# Altium project Smart-Telecontrol.PrjPcb
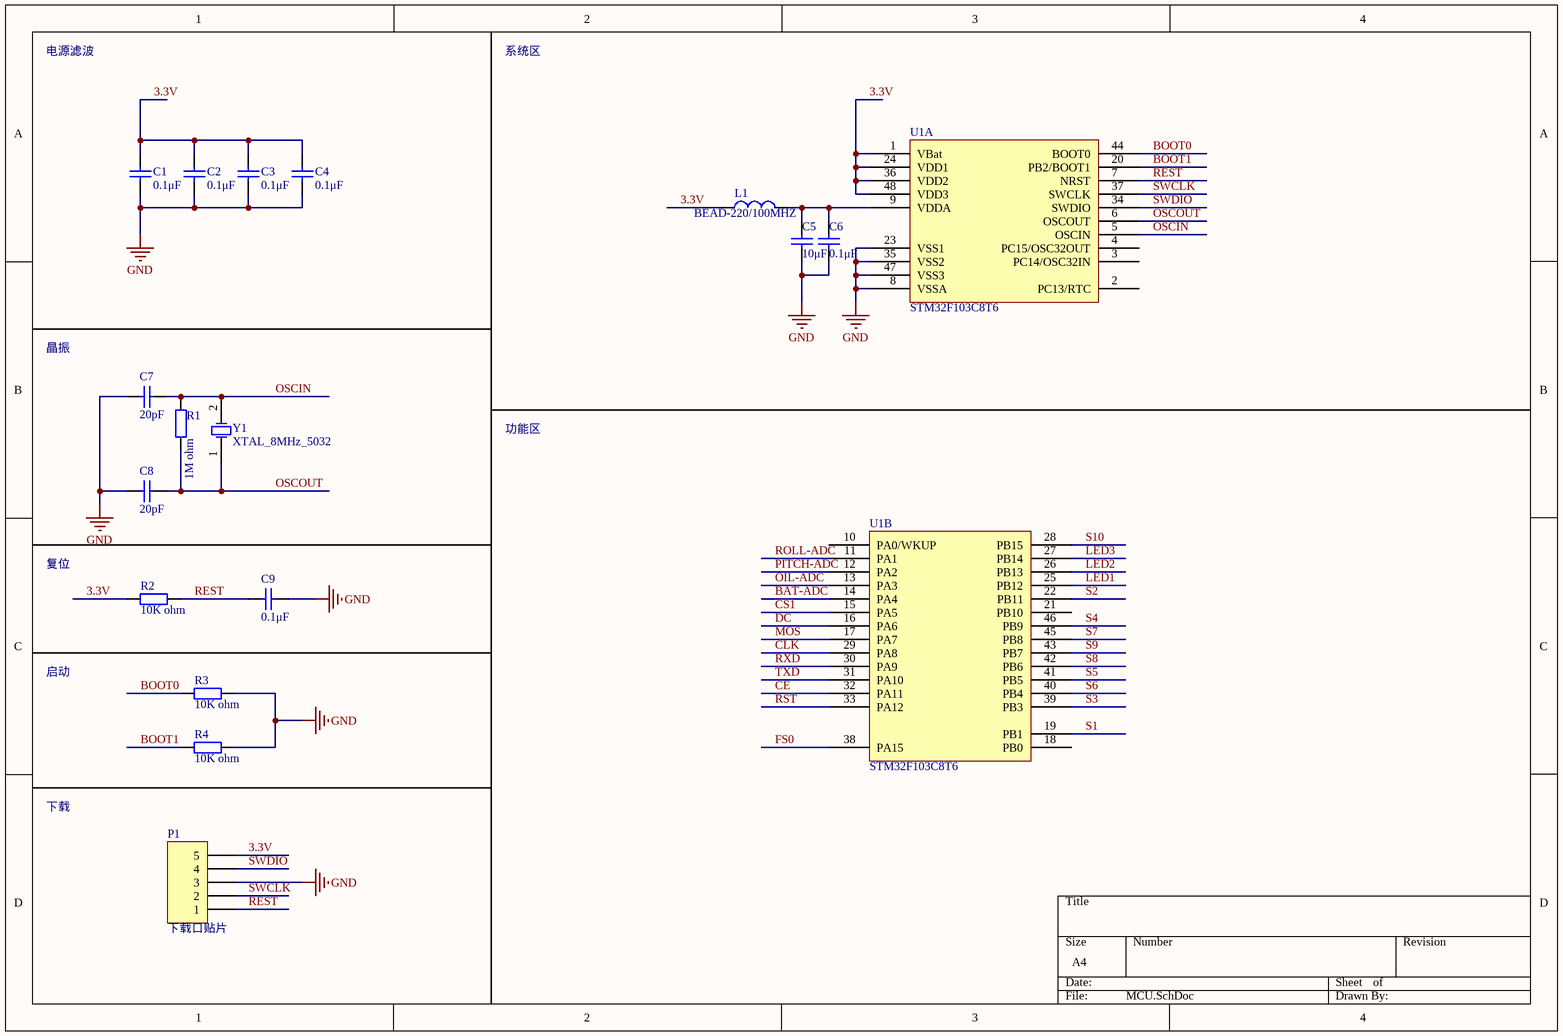
[diagram p0: MCU.SchDoc]
2 sheets, 92 parts. Net scope: global (net labels, ports and power ports of the same name join across sheets).
Board file: Smart-Telecontrol.PcbDoc
Sheets:
  MCU.SchDoc
  Module.SchDoc

## Sheet MCU.SchDoc
size A4

### Parts
C1  0.1μF  [0603C]
C2  0.1μF  [0603C]
C3  0.1μF  [0603C]
C4  0.1μF  [0603C]
C5  10μF  [0603C]
C6  0.1μF  [0603C]
C7  20pF  [0603C]
C8  20pF  [0603C]
C9  0.1μF  [0603C]
L1  BEAD-220/100MHZ  [0603R]
P1  下载口贴片  [HDR1X5 - danceng]
R1  1M ohm  [0603R]
R2  10K ohm  [0603R]
R3  10K ohm  [0603R]
R4  10K ohm  [0603R]
U1  STM32F103C8T6  [LQFP48]  (parts A,B of 2)
Y1  XTAL_8MHz_5032  [5032]

### Nets
GND: C1.1 C2.1 C3.1 C4.1 C5.1 C6.1 C7.2 C8.2 C9.1 P1.3 R3.2 R4.2 U1.8(VSSA) U1.23(VSS1) U1.35(VSS2) U1.47(VSS3)
3.3V: C1.2 C2.2 C3.2 C4.2 L1.1 P1.5 R2.1 U1.1(VBat) U1.24(VDD1) U1.36(VDD2) U1.48(VDD3)
BAT-ADC: U1.14(PA4)
BOOT0: R3.1 U1.44(BOOT0)
BOOT1: R4.1 U1.20(PB2/BOOT1)
CE: U1.32(PA11)
CLK: U1.29(PA8)
CS1: U1.15(PA5)
DC: U1.16(PA6)
FS0: U1.38(PA15)
LED1: U1.25(PB12)
LED2: U1.26(PB13)
LED3: U1.27(PB14)
MOS: U1.17(PA7)
OIL-ADC: U1.13(PA3)
OSCIN: C7.1 R1.2 U1.5(OSCIN) Y1.2(OSC2)
OSCOUT: C8.1 R1.1 U1.6(OSCOUT) Y1.1(OSC1)
PITCH-ADC: U1.12(PA2)
REST: C9.2 P1.1 R2.2 U1.7(NRST)
ROLL-ADC: U1.11(PA1)
RST: U1.33(PA12)
RXD: U1.30(PA9)
S1: U1.19(PB1)
S2: U1.22(PB11)
S3: U1.39(PB3)
S4: U1.46(PB9)
S5: U1.41(PB5)
S6: U1.40(PB4)
S7: U1.45(PB8)
S8: U1.42(PB6)
S9: U1.43(PB7)
S10: U1.28(PB15)
SWCLK: P1.2 U1.37(SWCLK)
SWDIO: P1.4 U1.34(SWDIO)
TXD: U1.31(PA10)
NetC5_2: C5.2 C6.2 L1.2 U1.9(VDDA)

Not connected (* = marked no-connect by the designer): U1 2(PC13/RTC) 3(PC14/OSC32IN) 4(PC15/OSC32OUT) 10(PA0/WKUP) 18(PB0) 21(PB10)

### Notes on the sheet
- 电源滤波
- 系统区
- 晶振
- 功能区
- 复位
- 启动
- 下载

### Library data of the parts
C1-C4 C6 C9 = Cap_0.1μF_50V_0603: 0.1μF_50V,X7R,±5%; 物料名称: 贴片陶瓷电容; 制造商: muRata; 物料编码: TCC0087; 物料型号: GRM188R71H104JA93D; 单位: PCS; 物料规格: 0.1μF_50V,X7R,±5%
C5 = Cap_10μF_35V_0603: 10μF_35V,X5R,20%; 物料规格: 10μF_35V,20%; 物料名称: 贴片陶瓷电容; 制造商: muRata; 物料编码: TCC0071; 物料型号: GRM188R6YA106MA73D; 单位: PCS
C7 C8 = Cap_20pF_50V_0603: 20pF_50V,CH,±5%; 物料名称: 贴片陶瓷电容; 制造商: muRata; 物料编码: TCC0036; 物料型号: GRM1882C1H200JA01D; 单位: PCS; 物料规格: 20pF_50V,CH,±5%
L1 = BEAD-220/100MHZ_0603: 物料名称: 磁珠; 制造商: TDK; 物料编码: TCZ0006; 物料型号: MMZ1608B221CTAH0; 单位: PCS; 物料规格: BEAD-220/100MHZ
P1 = DAP下载口贴片: 制造商: NA; 单位: PCS; 物料规格: DAP下载口贴片; 物料名称: DAP下载口贴片; 物料编码: NA; 物料型号: DAP下载口贴片
R1 = Res_1M ohm_0603: 1M ohm,1%; 物料名称: 贴片电阻; 制造商: YAGEO; 物料编码: TRS0067; 物料型号: RC0603FR-071ML; 单位: PCS; 物料规格: 1M ohm,1%
R2-R4 = Res_10K ohm_0603: 10K ohm,1%; 物料名称: 贴片电阻; 制造商: YAGEO; 物料编码: TRS0020; 物料型号: RC0603FR-0710KL; 单位: PCS; 物料规格: 10K ohm,1%
U1 = STM32F103C8T6: 物料名称: 单片机; 制造商: ST; 物料编码: TIC0036; 单位: PCS; 物料规格: STM32F103C8T6; 物料型号: STM32F103C8T6
Y1 = XTAL_8MHz_5032: XTAL_8MHz; 物料规格: 8MHz; 物料名称: 晶振; 制造商: TAITIEN; 物料编码: NA; 物料型号: XIHCCCNANF-8.000; 单位: PCS

## Sheet Module.SchDoc
size A3
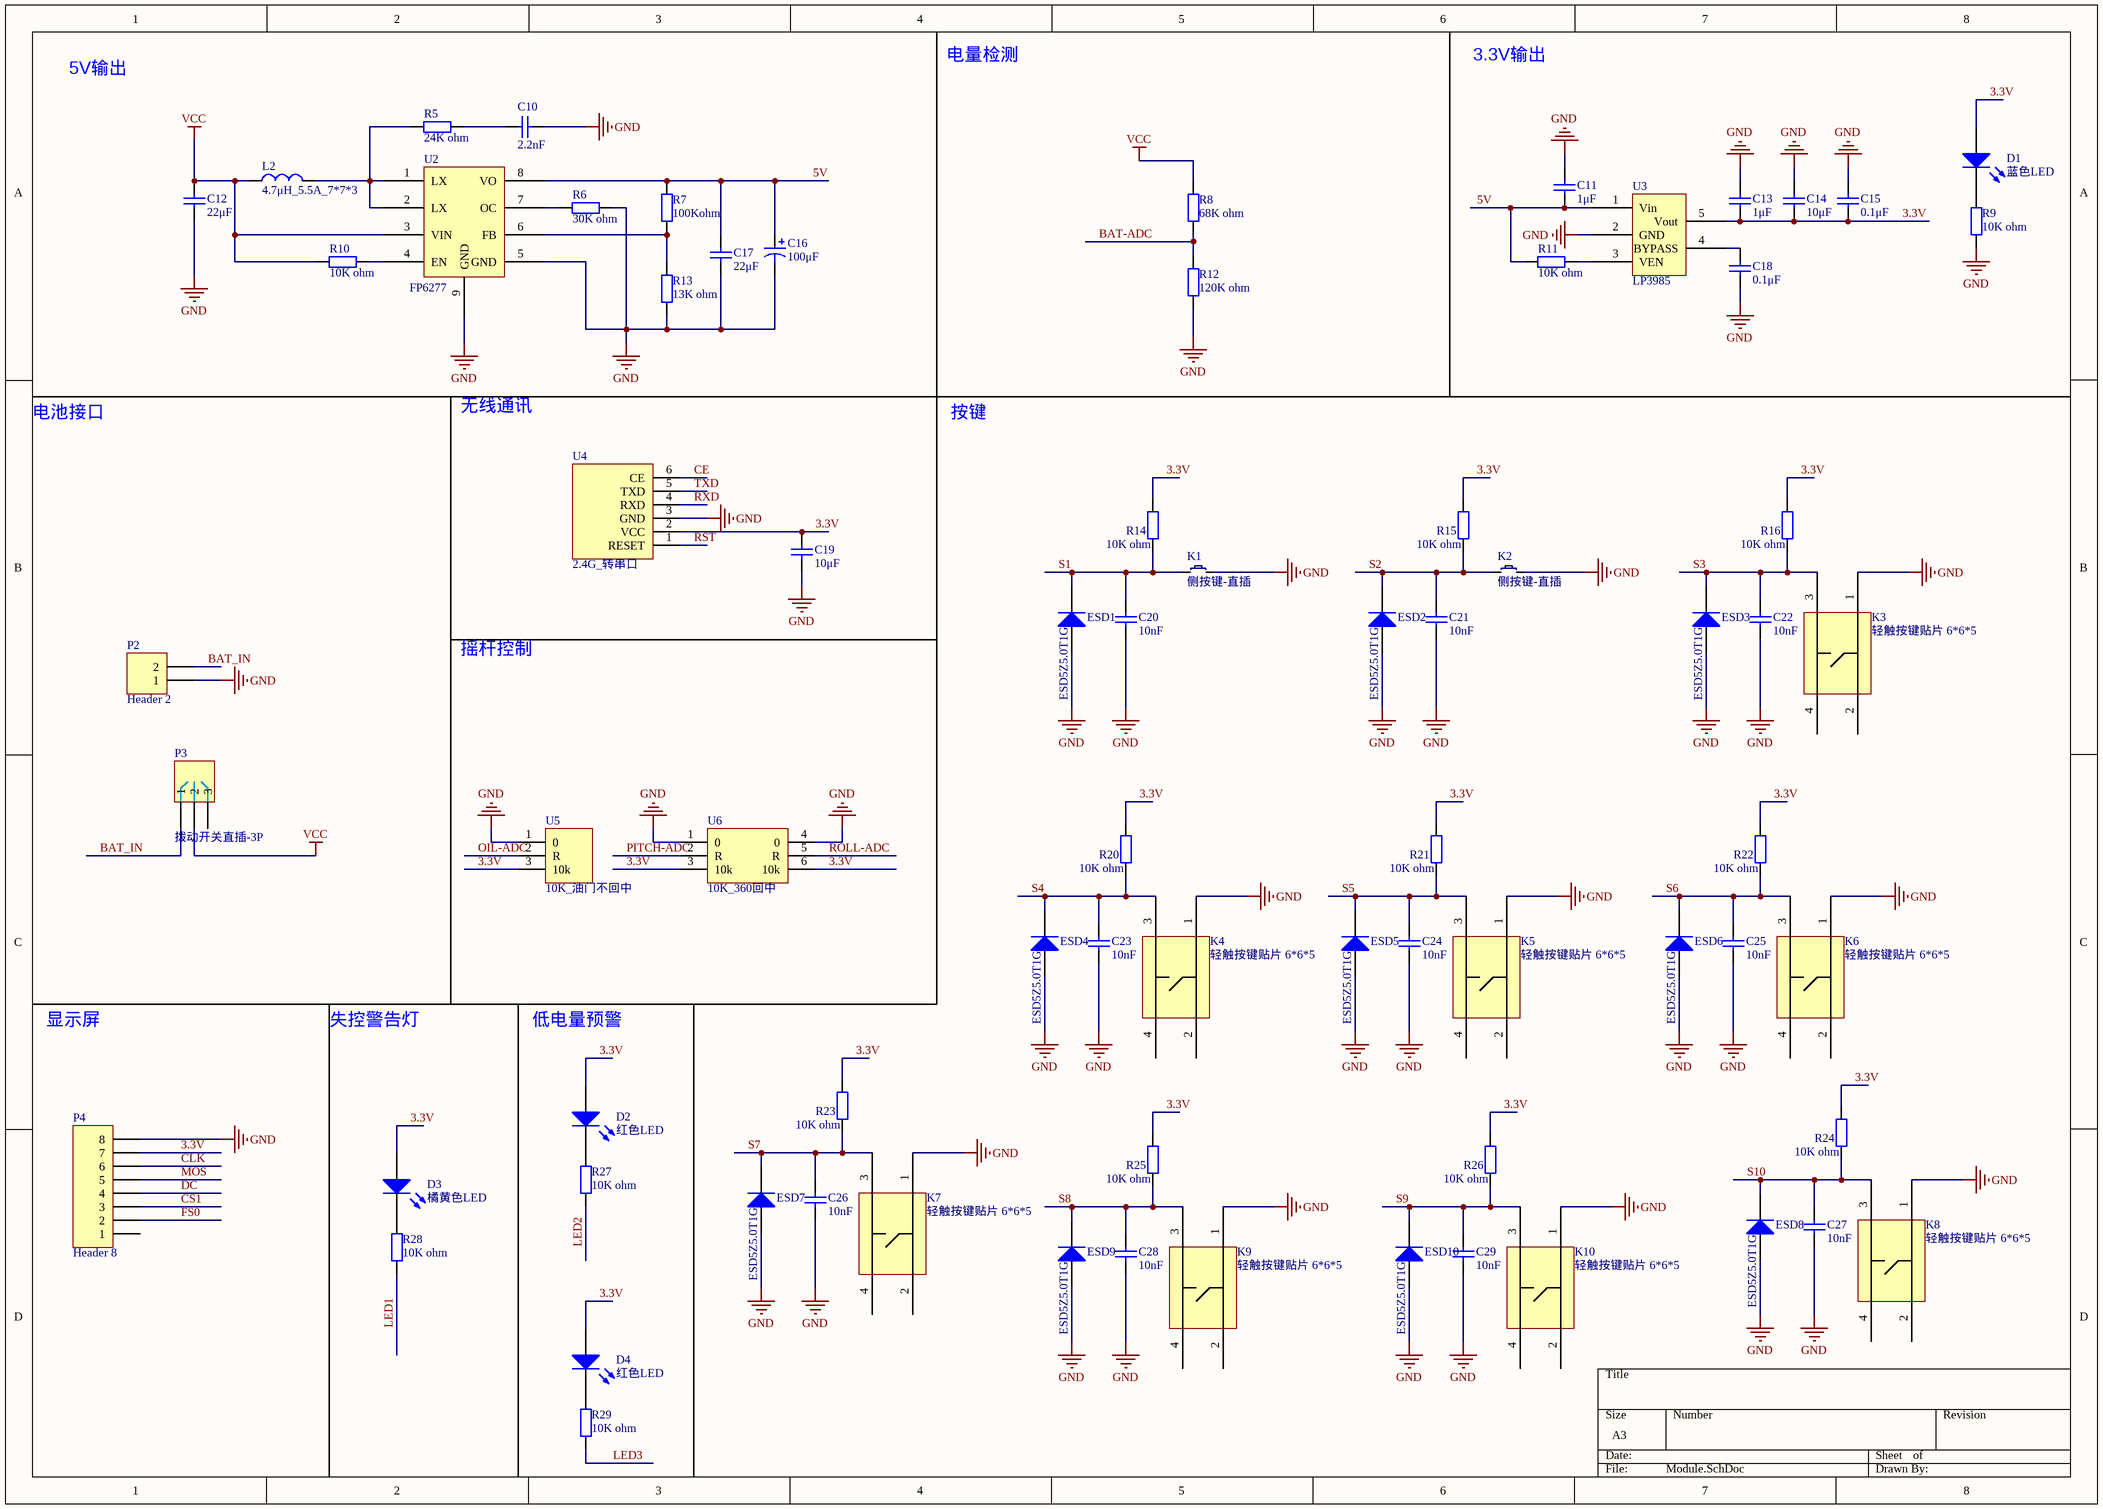
[diagram p1: Module.SchDoc]

### Parts
C10  2.2nF  [0603C]
C11  1μF  [0603C]
C12  22μF  [1206C]
C13  1μF  [0603C]
C14  10μF  [0603C]
C15  0.1μF  [0603C]
C16  100μF  [D7343C]
C17  22μF  [1206C]
C18  0.1μF  [0603C]
C19  10μF  [0603C]
C20  10nF  [0603C]
C21  10nF  [0603C]
C22  10nF  [0603C]
C23  10nF  [0603C]
C24  10nF  [0603C]
C25  10nF  [0603C]
C26  10nF  [0603C]
C27  10nF  [0603C]
C28  10nF  [0603C]
C29  10nF  [0603C]
D1  蓝色LED  [0603LED]
D2  红色LED  [0603LED]
D3  橘黄色LED  [0603LED]
D4  红色LED  [0603LED]
ESD1  ESD5Z5.0T1G  [SOD523]
ESD2  ESD5Z5.0T1G  [SOD523]
ESD3  ESD5Z5.0T1G  [SOD523]
ESD4  ESD5Z5.0T1G  [SOD523]
ESD5  ESD5Z5.0T1G  [SOD523]
ESD6  ESD5Z5.0T1G  [SOD523]
ESD7  ESD5Z5.0T1G  [SOD523]
ESD8  ESD5Z5.0T1G  [SOD523]
ESD9  ESD5Z5.0T1G  [SOD523]
ESD10  ESD5Z5.0T1G  [SOD523]
K1  侧按键-直插  [侧按键-直插]
K2  侧按键-直插  [侧按键-直插]
K3  轻触按键贴片 6*6*5  [轻触按键贴片 6*6*5]
K4  轻触按键贴片 6*6*5  [轻触按键贴片 6*6*5]
K5  轻触按键贴片 6*6*5  [轻触按键贴片 6*6*5]
K6  轻触按键贴片 6*6*5  [轻触按键贴片 6*6*5]
K7  轻触按键贴片 6*6*5  [轻触按键贴片 6*6*5]
K8  轻触按键贴片 6*6*5  [轻触按键贴片 6*6*5]
K9  轻触按键贴片 6*6*5  [轻触按键贴片 6*6*5]
K10  轻触按键贴片 6*6*5  [轻触按键贴片 6*6*5]
L2  4.7μH_5.5A_7*7*3  [7*7*3mm - 06030]
P2  Header 2  [HDR1X2]
P3  拨动开关直插-3P  [拨动开关-3P]
P4  Header 8  [HDR1X8]
R5  24K ohm  [0603R]
R6  30K ohm  [0603R]
R7  100Kohm  [0603R]
R8  68K ohm  [0603R]
R9  10K ohm  [0603R]
R10  10K ohm  [0603R]
R11  10K ohm  [0603R]
R12  120K ohm  [0603R]
R13  13K ohm  [0603R]
R14  10K ohm  [0603R]
R15  10K ohm  [0603R]
R16  10K ohm  [0603R]
R20  10K ohm  [0603R]
R21  10K ohm  [0603R]
R22  10K ohm  [0603R]
R23  10K ohm  [0603R]
R24  10K ohm  [0603R]
R25  10K ohm  [0603R]
R26  10K ohm  [0603R]
R27  10K ohm  [0603R]
R28  10K ohm  [0603R]
R29  10K ohm  [0603R]
U2  FP6277  [SO8 - FP6277]
U3  LP3985  [SOT-23-5]
U4  2.4G_转串口  [2.4G-串口]
U5  10K_油门不回中  [10K_油门不回中]
U6  10K_360回中  [10K_360回中]

### Nets
GND: C10.1 C11.1 C12.1 C13.1 C14.2 C15.2 C16.2 C17.1 C18.1 C19.1 C20.2 C21.2 C22.2 C23.2 C24.2 C25.2 C26.2 C27.2 C28.2 C29.2 ESD1.1(A) ESD2.1(A) ESD3.1(A) ESD4.1(A) ESD5.1(A) ESD6.1(A) ESD7.1(A) ESD8.1(A) ESD9.1(A) ESD10.1(A) K1.2 K2.2 K3.1 K4.1 K5.1 K6.1 K7.1 K8.1 K9.1 K10.1 P2.1 P4.8 R6.2 R9.1 R12.1 R13.1 U2.5(GND) U2.9(GND) U3.2(GND) U4.3(GND) U5.1(0) U6.1(0) U6.4(0)
VCC: C12.2 L2.1 P3.2 R8.2 R10.1 U2.3(VIN)
3.3V: C13.2 C14.1 C15.1 C19.2 D1.1(A) D2.1(A) D3.1(A) D4.1(A) P4.7 R14.2 R15.2 R16.2 R20.2 R21.2 R22.2 R23.2 R24.2 R25.2 R26.2 U3.5(Vout) U4.2(VCC) U5.3(10k) U6.3(10k) U6.6(10k)
5V: C11.2 C16.1 C17.2 R7.2 R11.1 U2.8(VO) U3.1(Vin)
BAT-ADC: R8.1 R12.2
BAT_IN: P2.2 P3.1
CE: U4.6(CE)
CLK: P4.6
CS1: P4.3
DC: P4.4
FS0: P4.2
LED1: R28.1
LED2: R27.1
LED3: R29.1
MOS: P4.5
OIL-ADC: U5.2(R)
PITCH-ADC: U6.2(R)
ROLL-ADC: U6.5(R)
RST: U4.1(RESET)
RXD: U4.4(RXD)
S1: C20.1 ESD1.2(K) K1.1 R14.1
S2: C21.1 ESD2.2(K) K2.1 R15.1
S3: C22.1 ESD3.2(K) K3.3 R16.1
S4: C23.1 ESD4.2(K) K4.3 R20.1
S5: C24.1 ESD5.2(K) K5.3 R21.1
S6: C25.1 ESD6.2(K) K6.3 R22.1
S7: C26.1 ESD7.2(K) K7.3 R23.1
S8: C28.1 ESD9.2(K) K9.3 R25.1
S9: C29.1 ESD10.2(K) K10.3 R26.1
S10: C27.1 ESD8.2(K) K8.3 R24.1
TXD: U4.5(TXD)
NetC10_2: C10.2 R5.1
NetC18_2: C18.2 U3.4(BYPASS)
NetD1_2: D1.2(K) R9.2
NetD2_2: D2.2(K) R27.2
NetD3_2: D3.2(K) R28.2
NetD4_2: D4.2(K) R29.2
NetL2_2: L2.2 R5.2 U2.1(LX) U2.2(LX)
NetR6_1: R6.1 U2.7(OC)
NetR7_1: R7.1 R13.2 U2.6(FB)
NetR10_2: R10.2 U2.4(EN)
NetR11_2: R11.2 U3.3(VEN)

Not connected (* = marked no-connect by the designer): K3 2 4; K4 2 4; K5 2 4; K6 2 4; K7 2 4; K8 2 4; K9 2 4; K10 2 4; P3 3; P4 1

### Notes on the sheet
- 5V输出
- 电量检测
- 3.3V输出
- 电池接口
- 无线通讯
- 按键
- 摇杆控制
- 显示屏
- 失控警告灯
- 低电量预警

### Library data of the parts
C10 = Cap_2.2nF_50V_0603: 2.2nF_50V,X7R,10%; 物料名称: 贴片陶瓷电容; 制造商: muRata; 物料编码: NA; 单位: PCS; 物料规格: 2.2nF_50V,X7R,10%; 物料型号: NA
C11 C13 = Cap_1μF_50V_0603: 1μF_50V,X5R,±10%; 物料名称: 贴片陶瓷电容; 制造商: muRata; 物料编码: TCC0040; 物料型号: GRM188R61H105KAALD; 单位: PCS; 物料规格: 1μF_50V,X5R,±10%
C12 C17 = Cap_22μF_35V_1206: 22μF_35V,20%; 物料名称: 贴片陶瓷电容; 制造商: TDK; 物料编码: NA; 物料型号: C3216JB1V226M160AC; 单位: PCS; 物料规格: 22μF_35V,20%
C14 C19 = Cap_10μF_35V_0603: as C5 on sheet MCU
C15 C18 = Cap_0.1μF_50V_0603: as C1 on sheet MCU; 物料规格: 0.1μF_50V,X7R,±5%
C16 = Cap_100μF_16V_D7343: 100μF_16V; 物料名称: 钽电容; 制造商: AVX; 物料编码: NA; 单位: PCS; 物料规格: 100μF_16V; 物料型号: NA
C20-C29 = Cap_10nF_50V_0603: 10nF_50V,SL_0603,±5%; 物料名称: 贴片陶瓷电容; 制造商: muRata; 物料编码: NA; 物料型号: GRM1881X1H103JA01; 单位: PCS; 物料规格: 10nF_50V,SL_0603,±5%
D1-D4 = 蓝色LED: 物料规格: LED(蓝色）; 制造商: VISHAY; 物料编码: TRG0035; 物料型号: TLMB1100; 单位: PCS; 物料名称: LED(蓝色）
ESD1-ESD10 = ESD5Z5.0T1G_SOD523: 物料名称: ESD二极管; 制造商: 安森美; 物料编码: NA; 单位: PCS; 物料规格: ESD5Z5.0T1G; 物料型号: ESD5Z5.0T1G
K1 K2 = 侧按键-直插: 制造商: 淘宝; 物料编码: NA; 单位: PCS; 物料规格: 侧按键-直插; 物料名称: 侧按键-直插; 物料型号: 侧按键-直插
K3-K10 = 轻触按键贴片 6*6*5: 制造商: 淘宝; 物料编码: NA; 单位: PCS; 物料规格: 轻触按键贴片 6*6*5; 物料名称: 轻触按键贴片 6*6*5; 物料型号: 轻触按键贴片 6*6*5
L2 = 4.7μH_5.5A_7*7*3: 4.7μH_5.5A_; 物料名称: 功率电感; 制造商: 台湾奇力新; 物料编码: NA; 物料型号: MHCC10040-4R7M-R8_06030; 单位: PCS; 物料规格: 4.7μH_5.5A_7*7*3
P2 = Header 2: Header, 2-Pin; LatestRevisionDate: 17-Jul-2002; LatestRevisionNote: Re-released for DXP Platform.; Publisher: Altium Limited
P3 = 拨动开关直插-3P: 制造商: NA; 单位: PCS; 物料规格: 拨动开关直插-3P; 物料名称: 拨动开关直插-3P; 物料编码: NA; 物料型号: 拨动开关直插-3P
P4 = Header 8: Header, 8-Pin; LatestRevisionDate: 17-Jul-2002; LatestRevisionNote: Re-released for DXP Platform.; Publisher: Altium Limited
R5 = Res_24K ohm_0603: 24K ohm,1%; 物料名称: 贴片电阻; 制造商: YAGEO; 物料编码: NA; 物料型号: RC0603FR-0724KL; 单位: PCS; 物料规格: 24K ohm,1%
R6 = Res_30K ohm_0603: 30K ohm,1%; 物料名称: 贴片电阻; 制造商: YAGEO; 物料编码: TRS0028; 物料型号: RC0603FR-0730KL; 单位: PCS; 物料规格: 30K ohm,1%
R7 = Res_100Kohm_0603: 100K ohm_5%; 物料名称: 贴片电阻; 制造商: YAGEO; 物料编码: TRS0032; 物料型号: RC0603JR-07100K; 单位: PCS; 物料规格: 100K ohm_5%
R8 = Res_68K ohm_0603: 68K ohm,1%; 物料名称: 贴片电阻; 制造商: YAGEO; 物料编码: NA; 物料型号: RC0603FR-0768KL; 单位: PCS; 物料规格: 68K ohm,1%
R9-R11 R14-R16 R20-R29 = Res_10K ohm_0603: as R2 on sheet MCU; 物料规格: 10K ohm,1%
R12 = Res_120K ohm_0603: 120K ohm,1%; 物料名称: 贴片电阻; 制造商: YAGEO; 物料编码: NA; 物料型号: RC0603FR-07120KL; 单位: PCS; 物料规格: 120K ohm,1%
R13 = Res_13K ohm_0603: 13K ohm,1%; 物料名称: 贴片电阻; 制造商: YAGEO; 单位: PCS; 物料规格: 13K ohm,1%
U2 = FP6277: 物料名称: 升压芯片; 制造商: 台湾远翔; 物料编码: NA; 单位: PCS; 物料规格: FP6277; 物料型号: FP6277
U3 = LP3985: 物料名称: 3.3V LDO; 制造商: National Semiconductor; 物料编码: TIC0029; 物料型号: LP3985IM5-3.3/NOPB; 单位: PCS; 物料规格: LP3985
U4 = 2.4G_转串口: 制造商: NA; 单位: PCS; 物料规格: 2.4G_转串口; 物料名称: 2.4G_转串口; 物料编码: NA; 物料型号: 2.4G_转串口
U5 = 10K_油门不回中: 制造商: NA; 单位: PCS; 物料规格: 10K_油门不回中; 物料名称: 10K_油门不回中; 物料编码: NA; 物料型号: 10K_油门不回中
U6 = 10K_360回中: 制造商: NA; 单位: PCS; 物料规格: 10K_360回中; 物料名称: 10K_360回中; 物料编码: NA; 物料型号: 10K_360回中

## Nets that join several sheets
GND: MCU (16 pins), Module (53 pins)
3.3V: MCU (11 pins), Module (24 pins)
BAT-ADC: MCU (U1.14), Module (R8.1 R12.2)
CE: MCU (U1.32), Module (U4.6)
CLK: MCU (U1.29), Module (P4.6)
CS1: MCU (U1.15), Module (P4.3)
DC: MCU (U1.16), Module (P4.4)
FS0: MCU (U1.38), Module (P4.2)
LED1: MCU (U1.25), Module (R28.1)
LED2: MCU (U1.26), Module (R27.1)
LED3: MCU (U1.27), Module (R29.1)
MOS: MCU (U1.17), Module (P4.5)
OIL-ADC: MCU (U1.13), Module (U5.2)
PITCH-ADC: MCU (U1.12), Module (U6.2)
ROLL-ADC: MCU (U1.11), Module (U6.5)
RST: MCU (U1.33), Module (U4.1)
RXD: MCU (U1.30), Module (U4.4)
S1: MCU (U1.19), Module (C20.1 ESD1.2 K1.1 R14.1)
S2: MCU (U1.22), Module (C21.1 ESD2.2 K2.1 R15.1)
S3: MCU (U1.39), Module (C22.1 ESD3.2 K3.3 R16.1)
S4: MCU (U1.46), Module (C23.1 ESD4.2 K4.3 R20.1)
S5: MCU (U1.41), Module (C24.1 ESD5.2 K5.3 R21.1)
S6: MCU (U1.40), Module (C25.1 ESD6.2 K6.3 R22.1)
S7: MCU (U1.45), Module (C26.1 ESD7.2 K7.3 R23.1)
S8: MCU (U1.42), Module (C28.1 ESD9.2 K9.3 R25.1)
S9: MCU (U1.43), Module (C29.1 ESD10.2 K10.3 R26.1)
S10: MCU (U1.28), Module (C27.1 ESD8.2 K8.3 R24.1)
TXD: MCU (U1.31), Module (U4.5)